# Altium schematic sheet Power.SchDoc
size A4; SheetNumber: 1; SheetTotal: 3
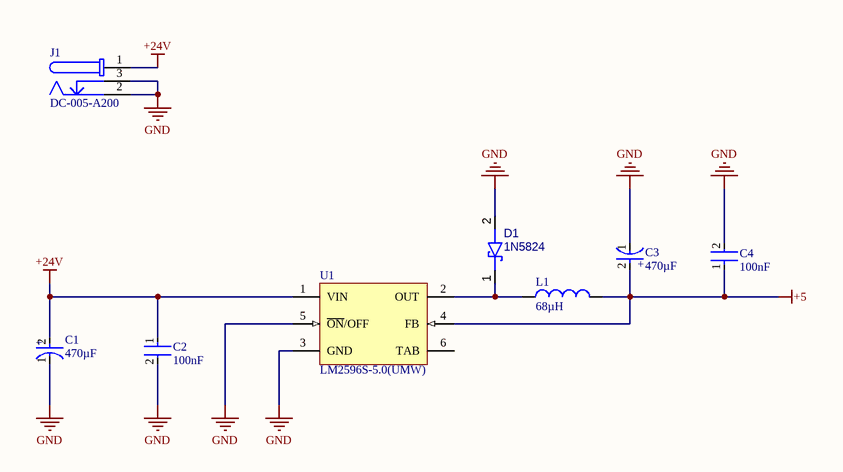
[diagram p0: Power.SchDoc]

## Parts
C1  value 470µF  [FP-A750MV227M1HAAE020-MFG]  (hidden comment: ERS1VM471G16OT)
C2  value 100nF  [FP-CC0603-DA-IPC_B]  (hidden comment: CC0603KRX7R9BB104)
C3  value 470µF  [FP-A750MV227M1HAAE020-MFG]  (hidden comment: ERS1VM471G16OT)
C4  value 100nF  [FP-CC0603-DA-IPC_B]  (hidden comment: CC0603KRX7R9BB104)
D1  1N5824  [FP-017AF-MFG]
J1  DC-005-A200  [694108301002]
L1  value 68µH  [CAPM115100X500N]  (hidden comment: YSPI1050-680M)
U1  LM2596S-5.0(UMW)  [KTT0005B_L]

## Nets
+5: C3.2(A) C4.1 L1.2 U1.4(FB)
+24V: C1.2(A) C2.1 J1.1 U1.1(VIN)
GND: C1.1(C) C2.2 C3.1(C) C4.2 D1.2(A) J1.2 J1.3 U1.3(GND) U1.5(~{ON}/OFF)
NetD1_1: D1.1(K) L1.1 U1.2(OUT)

Not connected (* = marked no-connect by the designer): U1 6(TAB)

## Notes on the sheet
- (in symbol CMP-001-00083-1) +
- (in symbol CMP-001-00083-2) +

## Library data of the parts
C1 = CMP-001-00083-2: 10mm 16mm 35V 470uF 5mm 7000hrs@105℃ ±20% 插件,D10xL16mm Aluminum Electrolytic Capacitors - Leaded ROHS; Manufacturer: AISHI(Aihua Group); Dissipation Factor: 12%; Voltage Rating (DC): 50V; Ripple Current: 215mA; Leakage Current: 2.2mA; Life (Hours): 2000hours; ESR (Equivalent Series Resistance): 20mΩ; Length: 14mm; Case/Package: Radial; Tolerance: 20%; REACH SVHC: Yes; Diameter: 10mm; Voltage Rating: 35V; Height: 16mm; Packaging: Bulk; Lifecycle Status: Production; Max Operating Temperature: 105°C; Terminal Pitch: 5mm; Number of Terminals: 2; Min Operating Temperature: -55°C; RoHS: Compliant; MFR.Part #: ERS1VM471G16OT; JLCPCB Part #: C106703
C2 = CMP-001-00084-2: Multilayer Ceramic Capacitor, CC Series, 0.1 - F, - 10%, X7R, 50 V, 0603 [1608 Metric]; Manufacturer: YAGEO; Voltage Rating (DC): 50V; Pins: 2; Case Code (Imperial): 0603; Length: 1.6mm; Case Code (Metric): 1608; Introduction Date: 2005-08-18; Mounting Technology: Surface Mount; Case/Package: 0603; Country of Origin: Mainland China, Taiwan; Voltage Rating: 50V; Dielectric Material: Ceramic; Halogen Free: Halogen Free; Thickness: 889µm; Number of Terminals: 2; Max Operating Temperature: 125°C; REACH SVHC: Yes; Depth: 800µm; Harmonized Tariff Schedule (HTS) Code: 8532.24.00.20; RoHS: Compliant; Width: 800µm; Min Operating Temperature: -55°C; Material: Ceramic; Lifecycle Status: Production; Termination: SMD/SMT; Voltage: 50V; Lead Free: Lead Free; Dielectric: X7R; Tolerance: 10%; Height: 800µm; Radiation Hardening: No; Schedule B: 8532240020, 8532240020; China RoHS: Compliant; Export Control Classification Number (ECCN) Code: EAR99; MFR.Part #: CC0603KRX7R9BB104; JLCPCB Part #: C14663
C3 = CMP-001-00083-1: 10mm 16mm 35V 470uF 5mm 7000hrs@105℃ ±20% 插件,D10xL16mm Aluminum Electrolytic Capacitors - Leaded ROHS; Dissipation Factor: 12%; Voltage Rating (DC): 50V; Ripple Current: 215mA; Leakage Current: 2.2mA; Life (Hours): 2000hours; ESR (Equivalent Series Resistance): 20mΩ; Length: 14mm; Case/Package: Radial; Tolerance: 20%; REACH SVHC: Yes; Diameter: 10mm; Voltage Rating: 35V; Height: 16mm; Packaging: Bulk; Lifecycle Status: Production; Max Operating Temperature: 105°C; Terminal Pitch: 5mm; Number of Terminals: 2; Min Operating Temperature: -55°C; RoHS: Compliant
C4 = CMP-001-00084-1: Multilayer Ceramic Capacitor, CC Series, 0.1 - F, - 10%, X7R, 50 V, 0603 [1608 Metric]; Voltage Rating (DC): 50V; Pins: 2; Case Code (Imperial): 0603; Length: 1.6mm; Case Code (Metric): 1608; Introduction Date: 2005-08-18; Mounting Technology: Surface Mount; Case/Package: 0603; Country of Origin: Mainland China, Taiwan; Voltage Rating: 50V; Dielectric Material: Ceramic; Halogen Free: Halogen Free; Thickness: 889µm; Number of Terminals: 2; Max Operating Temperature: 125°C; REACH SVHC: Yes; Depth: 800µm; Harmonized Tariff Schedule (HTS) Code: 8532.24.00.20; RoHS: Compliant; Width: 800µm; Min Operating Temperature: -55°C; Material: Ceramic; Lifecycle Status: Production; Termination: SMD/SMT; Voltage: 50V; Lead Free: Lead Free; Dielectric: X7R; Tolerance: 10%; Height: 800µm; Radiation Hardening: No; Schedule B: 8532240020, 8532240020; China RoHS: Compliant; Export Control Classification Number (ECCN) Code: EAR99
D1 = CMP-004-00031-2: -55℃~+150℃ 150A 30V 500uA@30V 550mV@5A 5A Independent DO-201AD Schottky Diodes ROHS; Manufacturer: FUXINSEMI; Average Rectified Current: 3A; Max Power Dissipation: 6.25W; Max Junction Temperature (Tj): 150°C; Number of Elements: 1; Reverse Voltage: 400V; Forward Voltage: 550mV; Max Forward Surge Current (Ifsm): 125A; Element Configuration: Single; Natural Thermal Resistance: 20°C/W; Reverse Recovery Time: 50ns; Polarity: Standard; Value: 75pF; Number of Terminals: 2; Pins: 2; Output Current: 5A; Height: 5.6mm; Power Dissipation: 6.25W; Mounting Technology: Through Hole; Max Reverse Voltage (DC): 400V; Diameter: 5.6mm; Voltage Rating (DC): 400V; Max Surge Current: 150A; Max Output current: 3A; Recovery Time: 50ns; MFR.Part #: 1N5824; JLCPCB Part #: C7503125; Package: DO-201AD; Max Operating Temperature: 150°C; Min Operating Temperature: -65°C; Case/Package: Axial; Forward Current: 5A; Current Rating: 3A
J1 = CMP-002-00073-1: -20℃~+70℃ 2mm 30V 3A 6.4mm DC Power Jack Right Angle 插件 DC Power Connectors ROHS; Manufacturer Lifecycle Status: ACTIVE; Manufacturer: XUNPU; YEOL: 1 = Estimated lifetime > 10 years; Number of Contacts: 3; Shielding: Unshielded; Insulation Resistance: 100MΩ; Operating Supply Voltage: 24V; Gender: Male; Current Rating: 3A; Color: Black; Flammability Rating: UL94 V-0; JLCPCB Part #: C720557; Contact Gender: Female; Contact Material: Gold, Tin; Termination: Through Hole; MFR.Part #: DC-005-A200; RoHS: Compliant; REACH SVHC: Unknown; Connector Type: Power; Contact Plating: Tin; Housing Material: Polyamide; Max Operating Temperature: 70°C; Mounting Technology: Through Hole; Voltage Rating: 30V; Lifecycle Status: Production; Packaging: Bulk; Height: 11mm; Min Operating Temperature: -20°C
L1 = CMP-006-00021-1: 240mΩ 3A 4A 68uH Molded Inductor ±20% SMD,11.5x10mm Power Inductors ROHS; Manufacturer: YJYCOIN; Shielding: Unshielded; Test Frequency: 100kHz; Number of Circuits: 1; Height: 5mm; Min Operating Temperature: -40°C; JLCPCB Part #: C497902; Length: 11.5mm; MFR.Part #: YSPI1050-680M; DC Resistance (DCR): 240mΩ; Max Operating Temperature: 125°C; Number of Terminals: 2; Mounting Technology: SMD; Tolerance: 20%; Width: 10mm; Max Current Rating: 4A; Package: SMD,11.5x10mm; Pins: 2
U1 = CMP-031-00007-1: -40℃~+125℃@(TA) 1 150kHz 3A 5V 7V~40V 80uA Buck Buck Built-in Fixed No TO-263-5 DC-DC Converters ROHS; Manufacturer: UMW(Youtai Semiconductor Co., Ltd.); Number of Outputs: 1; Max Supply Voltage: 40V; Min Input Voltage: 4.5V; Efficiency: 80%; Switching Frequency: 173kHz; Quiescent Current: 5mA; Height: 4.83mm; Min Operating Temperature: -40°C; MFR.Part #: LM2596S-5.0(UMW); Nominal Output Voltage: 5V; Weight: 113.398093g; Mounting Technology: Surface Mount; Pins: 5; Frequency: 150kHz; Topology: Buck; Width: 8.42mm; Number of Channels: 1; Output Type: Fixed; Max Output current: 3A; Case/Package: TO-263; Output Voltage: 5V; Packaging: Cut Tape; Contact Plating: Tin; Max Operating Temperature: 125°C; JLCPCB Part #: C347421; Thickness: 4.58mm; Length: 10.16mm; Output Current: 3A; Operating Supply Voltage: 40V